# EAGLE schematic deltabot-heater-bed (EAGLE 6.3)
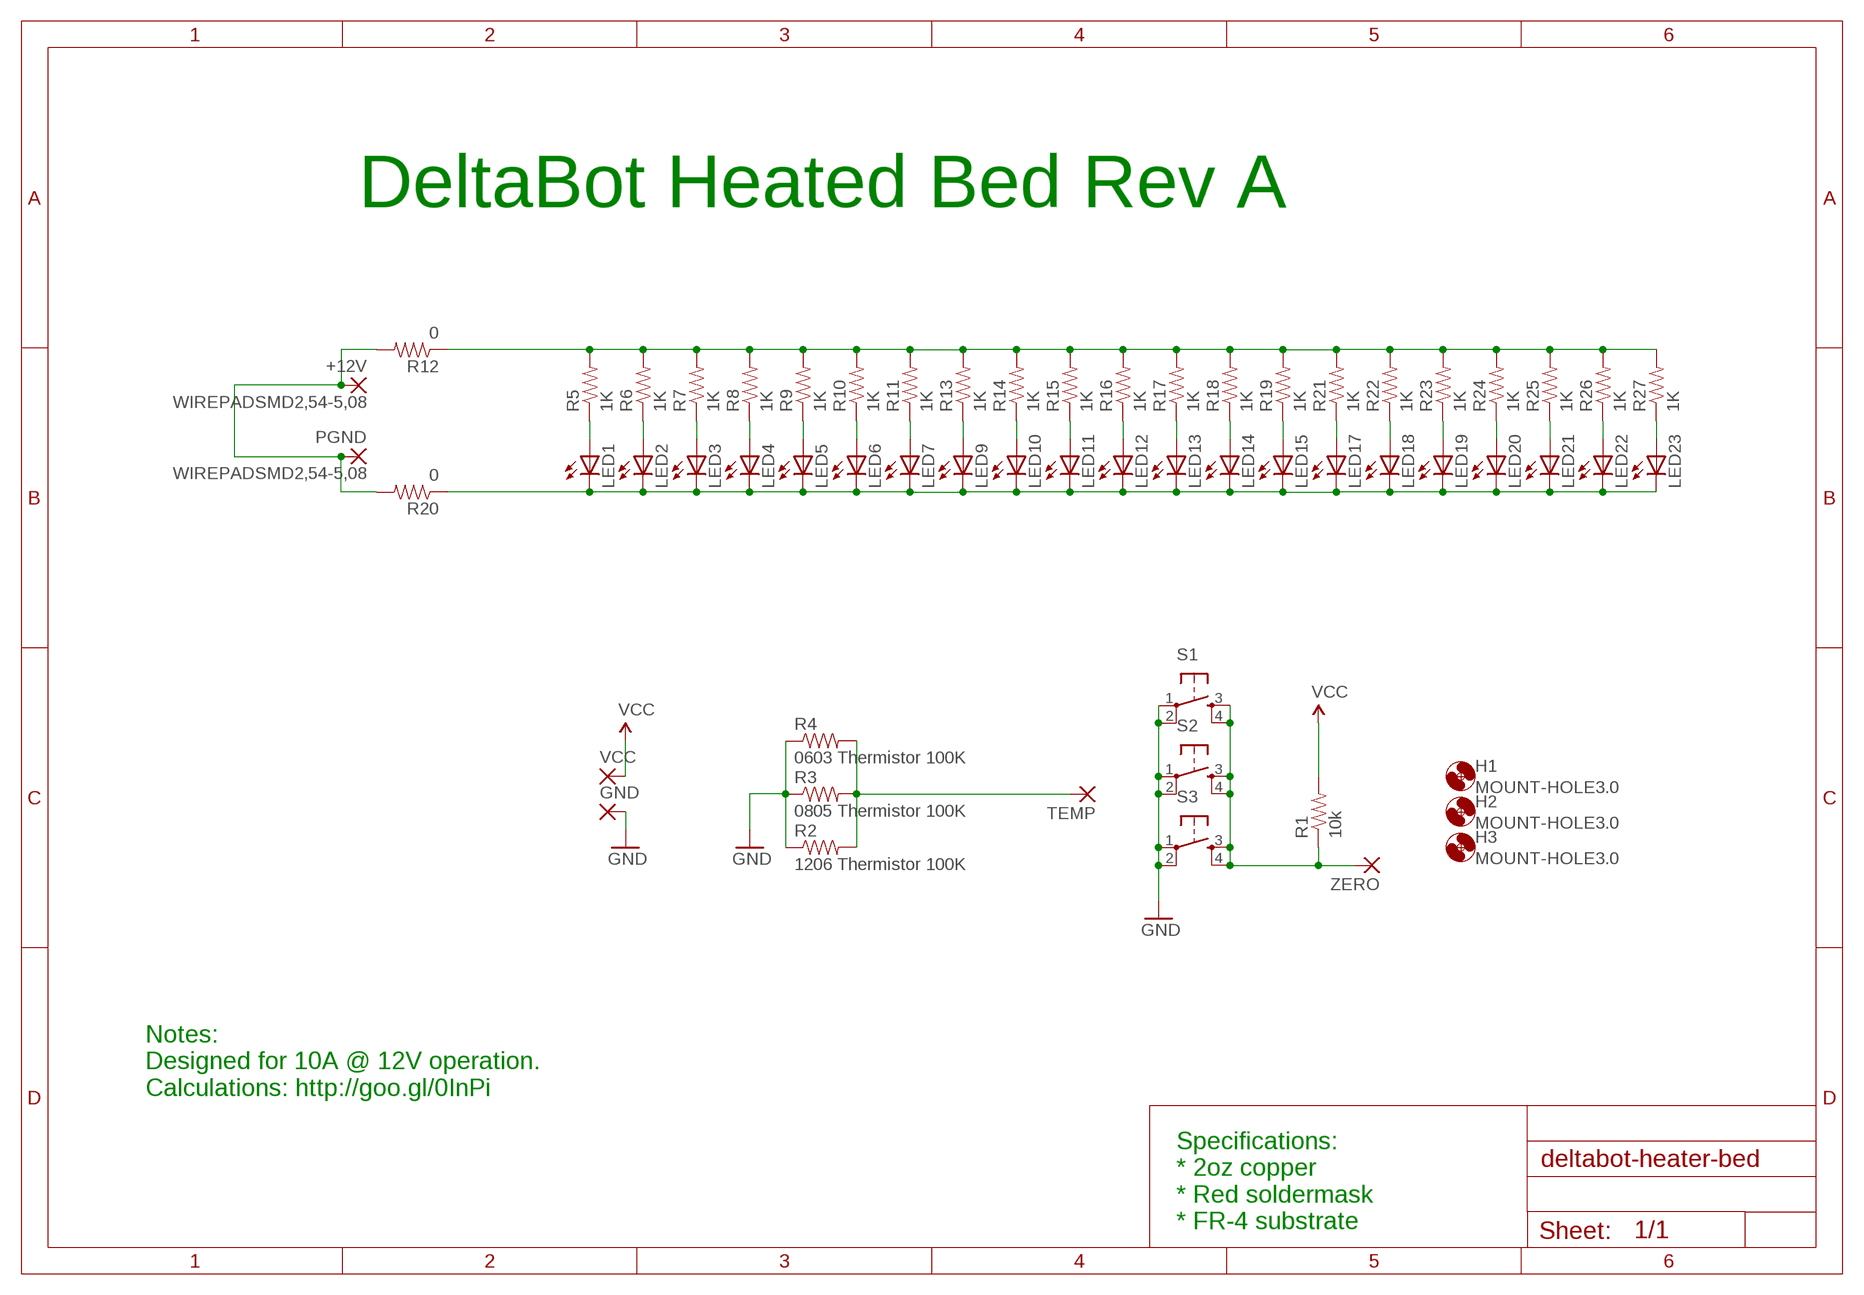
[diagram p0: schematic, sheet 1]

## Parts
+12V  WIREPADSMD2,54-5,08  [SMD2,54-5,08]
GND  SMD2  [SMD1,27-2,54]
H1  MOUNT-HOLE3.0  [3,0]
H2  MOUNT-HOLE3.0  [3,0]
H3  MOUNT-HOLE3.0  [3,0]
LED1  LED0805  [0805-LED]
LED2  LED0805  [0805-LED]
LED3  LED0805  [0805-LED]
LED4  LED0805  [0805-LED]
LED5  LED0805  [0805-LED]
LED6  LED0805  [0805-LED]
LED7  LED0805  [0805-LED]
LED9  LED0805  [0805-LED]
LED10  LED0805  [0805-LED]
LED11  LED0805  [0805-LED]
LED12  LED0805  [0805-LED]
LED13  LED0805  [0805-LED]
LED14  LED0805  [0805-LED]
LED15  LED0805  [0805-LED]
LED17  LED0805  [0805-LED]
LED18  LED0805  [0805-LED]
LED19  LED0805  [0805-LED]
LED20  LED0805  [0805-LED]
LED21  LED0805  [0805-LED]
LED22  LED0805  [0805-LED]
LED23  LED0805  [0805-LED]
PGND  WIREPADSMD2,54-5,08  [SMD2,54-5,08]
R1  10k  RESISTOR0805  [0805-RC]
R2  1206 Thermistor 100K  RESISTOR1206  [1206-RC]
R3  0805 Thermistor 100K  RESISTOR0805  [0805-RC]
R4  0603 Thermistor 100K  RESISTOR0603  [0603-RC]
R5  1K  RESISTOR0805  [0805-RC]
R6  1K  RESISTOR0805  [0805-RC]
R7  1K  RESISTOR0805  [0805-RC]
R8  1K  RESISTOR0805  [0805-RC]
R9  1K  RESISTOR0805  [0805-RC]
R10  1K  RESISTOR0805  [0805-RC]
R11  1K  RESISTOR0805  [0805-RC]
R12  0  RESISTOR0805  [0805-RC]
R13  1K  RESISTOR0805  [0805-RC]
R14  1K  RESISTOR0805  [0805-RC]
R15  1K  RESISTOR0805  [0805-RC]
R16  1K  RESISTOR0805  [0805-RC]
R17  1K  RESISTOR0805  [0805-RC]
R18  1K  RESISTOR0805  [0805-RC]
R19  1K  RESISTOR0805  [0805-RC]
R20  0  RESISTOR0805  [0805-RC]
R21  1K  RESISTOR0805  [0805-RC]
R22  1K  RESISTOR0805  [0805-RC]
R23  1K  RESISTOR0805  [0805-RC]
R24  1K  RESISTOR0805  [0805-RC]
R25  1K  RESISTOR0805  [0805-RC]
R26  1K  RESISTOR0805  [0805-RC]
R27  1K  RESISTOR0805  [0805-RC]
S1  TAC_SWITCHSMD  [TACTILE_SWITCH_SMD]
S2  TAC_SWITCHSMD  [TACTILE_SWITCH_SMD]
S3  TAC_SWITCHSMD  [TACTILE_SWITCH_SMD]
TEMP  SMD2  [SMD1,27-2,54]
VCC  SMD2  [SMD1,27-2,54]
ZERO  SMD2  [SMD1,27-2,54]

## Nets
12V: R5.2 R6.2 R7.2 R8.2 R9.2 R10.2 R11.2 R12.1 R13.2 R14.2 R15.2 R16.2 R17.2 R18.2 R19.2 R21.2 R22.2 R23.2 R24.2 R25.2 R26.2 R27.2
GND: GND.1(P) R2.1 R3.1 R4.1 S1.1 S1.2 S2.1 S2.2 S3.1 S3.2
HEATER: +12V.1(P) PGND.1(P) R12.2 R20.2
N$1: R2.2. R3.2 R4.2 TEMP.1(P)
N$2: LED1.A R5.1
N$3: LED2.A R6.1
N$4: R1.1 S1.3 S1.4 S2.3 S2.4 S3.3 S3.4 ZERO.1(P)
N$5: LED3.A R7.1
N$6: LED4.A R8.1
N$7: LED5.A R9.1
N$8: LED6.A R10.1
N$9: LED7.A R11.1
N$11: LED9.A R13.1
N$12: LED10.A R14.1
N$13: LED11.A R15.1
N$14: LED12.A R16.1
N$15: LED13.A R17.1
N$16: LED14.A R18.1
N$17: LED15.A R19.1
N$19: LED17.A R21.1
N$20: LED18.A R22.1
N$21: LED19.A R23.1
N$22: LED20.A R24.1
N$23: LED21.A R25.1
N$24: LED22.A R26.1
N$25: LED23.A R27.1
PGND: LED1.C LED2.C LED3.C LED4.C LED5.C LED6.C LED7.C LED9.C LED10.C LED11.C LED12.C LED13.C LED14.C LED15.C LED17.C LED18.C LED19.C LED20.C LED21.C LED22.C LED23.C R20.1
VCC: R1.2 VCC.1(P)

## Notes on the sheet
- DeltaBot Heated Bed Rev A
- Notes:
  Designed for 10A @ 12V operation.
  Calculations: http://goo.gl/0InPi
- Specifications:
  * 2oz copper
  * Red soldermask
  * FR-4 substrate

## Library data of the parts
+12V PGND = wirepad:WIREPAD: Wire PAD connect wire on PCB
GND TEMP VCC ZERO = wirepad:SMD2: SMD PAD
H1-H3 = holes:MOUNT-HOLE: MOUNTING HOLE with drill center marker
LED1-LED7 LED9-LED15 LED17-LED23 = Hoektronics:LED: LEDs Standard schematic elements and footprints for 5mm, 3mm, 1206, and 0603 sized LEDs. 5mm - Spark Fun Electronics SKU : COM-00529 (and others)
R1-R27 = Hoektronics:RESISTOR: Resistor Basic schematic elements and footprints for 0603, 1206, and PTH 1/10th watt (small) resistors.
S1-S3 = SparkFun-Electromechanical:TAC_SWITCH: Momentary Switch Button commonly used for reset or general input. Spark Fun Electronics SKU : COM-00097 SMT- SWCH-08247; PROD_ID: SWCH-08247